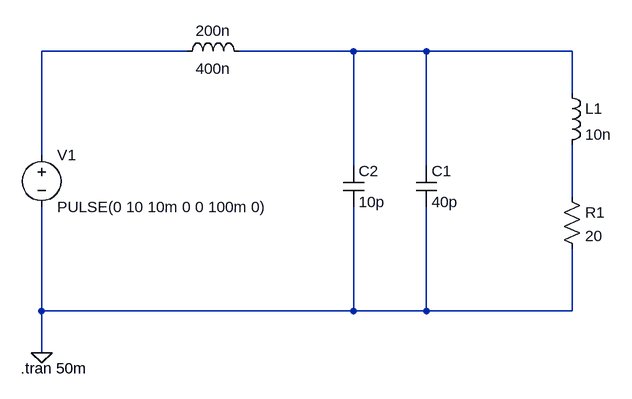
[diagram p0: schematic noise.asc]
noise.asc, the LTspice schematic file:
Version 4.1
SHEET 1 880 680
WIRE 48 -16 -176 -16
WIRE 304 -16 128 -16
WIRE 416 -16 304 -16
WIRE 640 -16 416 -16
WIRE 640 48 640 -16
WIRE -176 144 -176 -16
WIRE 304 160 304 -16
WIRE 416 160 416 -16
WIRE 640 208 640 128
WIRE -176 384 -176 224
WIRE 304 384 304 224
WIRE 304 384 -176 384
WIRE 416 384 416 224
WIRE 416 384 304 384
WIRE 640 384 640 288
WIRE 640 384 416 384
WIRE -176 448 -176 384
FLAG -176 448 0
SYMBOL voltage -176 128 R0
WINDOW 123 0 0 Left 0
WINDOW 39 0 0 Left 0
SYMATTR InstName V1
SYMATTR Value PULSE(0 10 10m 0 0 100m 0)
SYMBOL cap 400 160 R0
SYMATTR InstName C1
SYMATTR Value 40p
SYMBOL ind 624 32 R0
SYMATTR InstName L1
SYMATTR Value 10n
SYMBOL res 624 192 R0
SYMATTR InstName R1
SYMATTR Value 20
SYMBOL cap 288 160 R0
SYMATTR InstName C2
SYMATTR Value 10p
SYMBOL ind 32 0 R270
WINDOW 0 32 56 VTop 2
WINDOW 3 5 56 VBottom 2
SYMATTR InstName 200n
SYMATTR Value 400n
TEXT -208 472 Left 2 !.tran 50m

The netlist it stands for:
* noise.asc
V1 N001 0 PULSE(0 10 10m 0 0 100m 0)
C1 N002 0 40p
L1 N002 N003 10n
R1 N003 0 20
C2 N002 0 10p
L§200n N001 N002 400n
.tran 50m
.backanno
.end